# Altium schematic sheet Master MicroController Port J.SchDoc: Master Micro Controller Port J Pin Out
size A4; DocumentNumber: 24; SheetNumber: 24; SheetTotal: 54
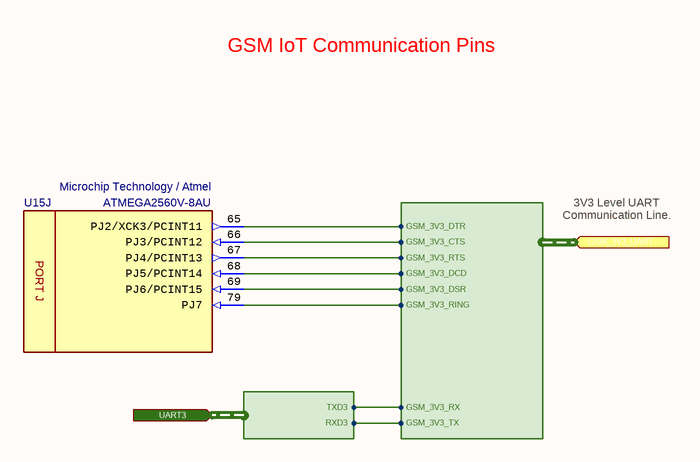
[diagram p0: Master MicroController Port J.SchDoc]

## Parts
U15  Manufacturer Part Number: ATMEGA2560V-8AU  Manufacturer Name: Microchip Technology / Atmel  [TQFP100]  (hidden comment: 8-bit MicroController)  (part J of 15)

## Ports
GSM_3V3_UART (in, harness GSM_3V3_UART), UART3 (in, harness UART3)

## Harnesses
GSM_3V3_UART: GSM_3V3_RX, GSM_3V3_TX, GSM_3V3_DTR, GSM_3V3_RTS, GSM_3V3_CTS, GSM_3V3_DCD, GSM_3V3_DSR, GSM_3V3_RING
UART3: RXD3, TXD3

## Nets
NetU15_65: U15.65(PJ2/XCK3/PCINT11) ; port GSM_3V3_UART.GSM_3V3_DTR
NetU15_66: U15.66(PJ3/PCINT12) ; port GSM_3V3_UART.GSM_3V3_CTS
NetU15_67: U15.67(PJ4/PCINT13) ; port GSM_3V3_UART.GSM_3V3_RTS
NetU15_68: U15.68(PJ5/PCINT14) ; port GSM_3V3_UART.GSM_3V3_DCD
NetU15_69: U15.69(PJ6/PCINT15) ; port GSM_3V3_UART.GSM_3V3_DSR
NetU15_79: U15.79(PJ7) ; port GSM_3V3_UART.GSM_3V3_RING
(unnamed): port GSM_3V3_UART.GSM_3V3_RX, port UART3.TXD3
(unnamed): port GSM_3V3_UART.GSM_3V3_TX, port UART3.RXD3

## Notes on the sheet
- GSM IoT Communication Pins
- 3V3 Level UART Communication Line.
- Engineer
- All Rights are reserved to Customer and Engineer. [2021]
- Size:
- Date:
- A4
- Project :
- Time:
- Sheet
- of
- Customer
- Product ID
- Module ID
- Version
- File:
- Revision
- (in symbol IC - ATMEGA2560V-8AU, part J) PORT J

## Library data of the parts
U15 = IC - ATMEGA2560V-8AU: 8-bit Microcontrollers - MCU 256kB Flash 4kB EEPROM 86 I/O Pins; Supply Voltage - Min: 2V7; Supply Voltage - Max: 5.5V; Height: 1mm; ComponentLink1Description: DataSheet; ComponentLink1URL: https://eu.mouser.com/datasheet/2/268/Atmel-2549-8-bit-AVR-Microcontroller-ATmega640-128-1315286.pdf; ROHS: Yes; Minimum Operating Temperature: -40; Maximum Operating Temperature: +85; ComponentLink2Description: Mouser; ComponentLink2URL: https://eu.mouser.com/ProductDetail/Microchip-Technology-Atmel/ATMEGA2560V-8AU?qs=sGAEpiMZZMutXGli8Ay4kKlCYcvZUWqJYdtgGFyqFT8%3D; Supplier 1: Digi-Key; Supplier 2: Newark; Supplier 3: Avnet; Supplier 4: RSComponents; Supplier 5: RSComponents; Supplier Part Number 1: ATMEGA2560V-8AU-ND; Supplier Part Number 2: 68T2784; Supplier Part Number 3: 68T2784; Supplier Part Number 4: 1278284P; Supplier Part Number 5: 1278284; Case: TQFP-100; Supplier 6: Mouser; Supplier 7: Future Electronics; Supplier 8: Avnet; Supplier 9: Arrow Electronics; Supplier 10: Farnell; Supplier 11: Allied Electronics; Supplier 12: Future Electronics; Supplier 13: RSComponents; Supplier 14: RSComponents; Supplier 15: RSComponents; Supplier Part Number 6: 556-ATMEGA2560V8AU; Supplier Part Number 7: 4038198; Supplier Part Number 8: ATMEGA2560V-8AU; Supplier Part Number 9: ATMEGA2560V-8AU; Supplier Part Number 10: 1288331; Supplier Part Number 11: 70124009; Supplier Part Number 12: ATMEGA2560V-8AU-TRAY; Supplier Part Number 13: 6963424; Supplier Part Number 14: 6963424P; Supplier Part Number 15: 9220809